# Altium schematic sheet Control.SchDoc: Control Module
size A3; SheetNumber: 2; SheetTotal: 7
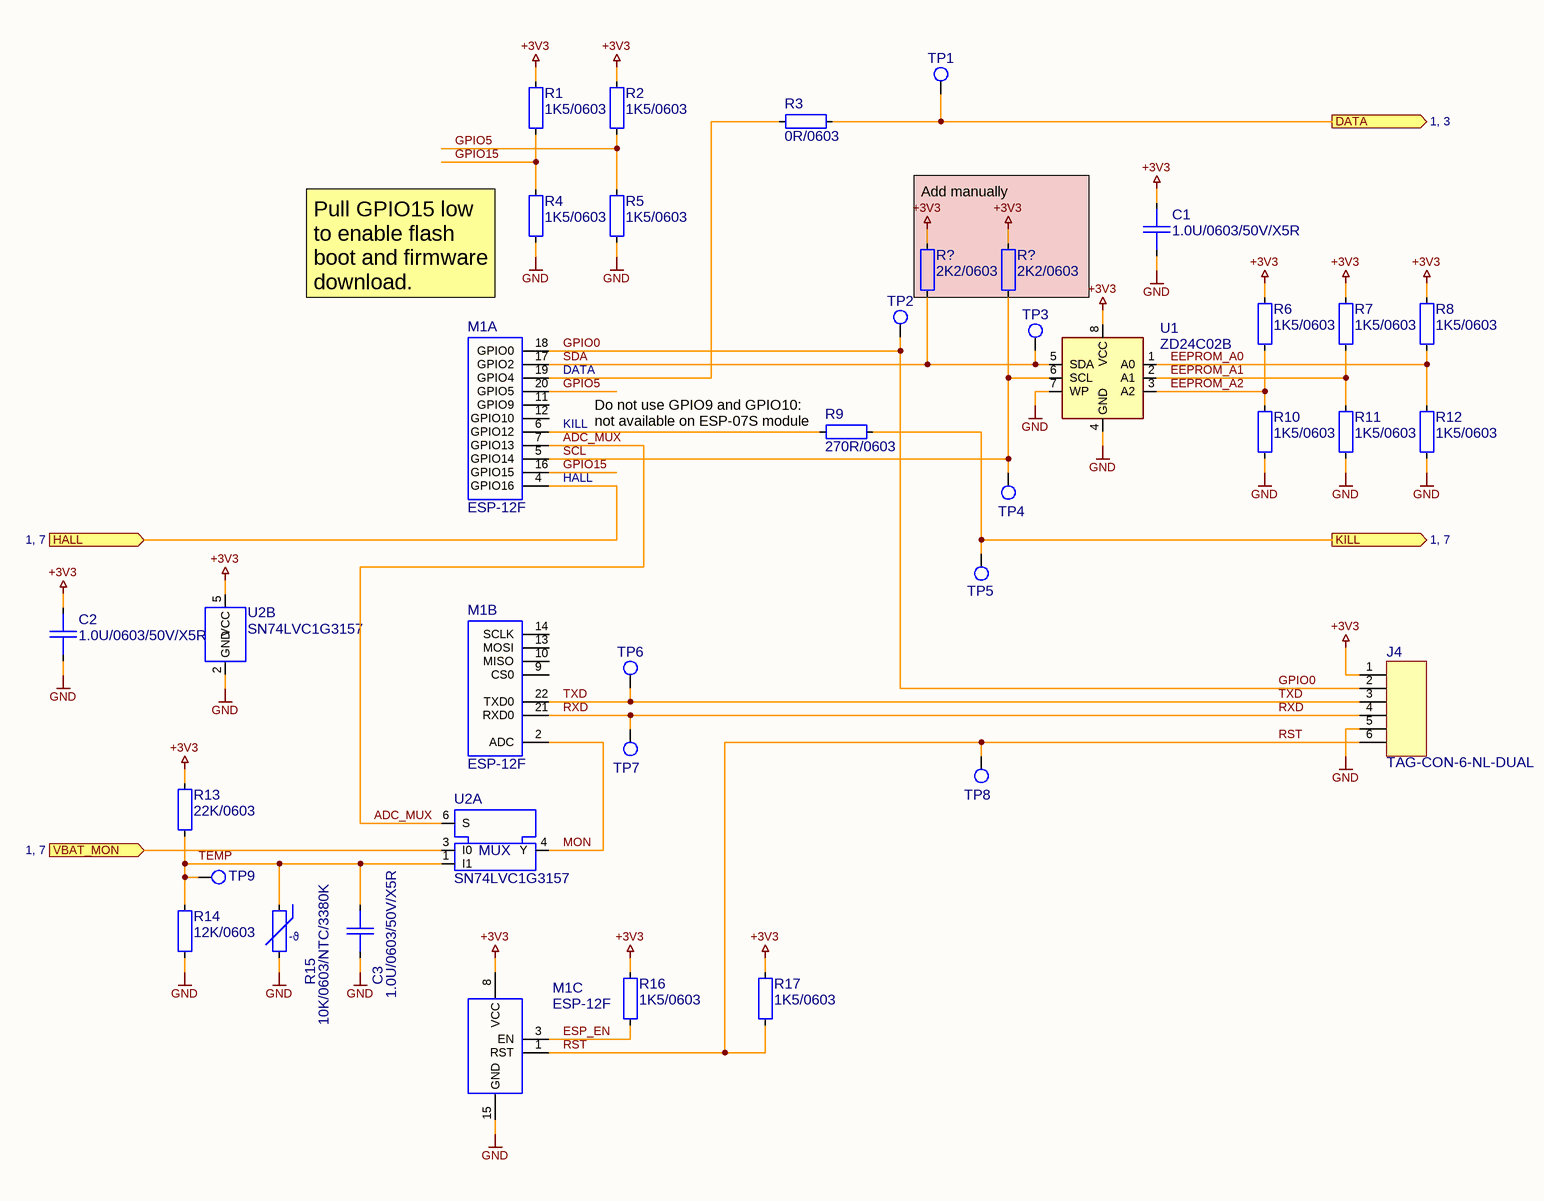
[diagram p0: Control.SchDoc]

## Parts
(Parts that share a designator on the sheet are numbered #1, #2 ... from top to bottom, then left to right.)
C1  1.0U/0603/50V/X5R  [CAP0603_X7R]
C2  1.0U/0603/50V/X5R  [CAP0603_X7R]
C3  1.0U/0603/50V/X5R  [CAP0603_X7R]
J4  TAG-CON-6-NL-DUAL  [TC2030-NL-2]
M1  ESP-12F  [ESP-12F]  (parts A,B,C of 3)
R1  1K5/0603  [R0603-0.40-WW]
R2  1K5/0603  [R0603-0.40-WW]
R3  0R/0603  [R0603-0.40-WW]
R4  1K5/0603  [R0603-0.40-WW]
R5  1K5/0603  [R0603-0.40-WW]
R6  1K5/0603  [R0603-0.40-WW]
R7  1K5/0603  [R0603-0.40-WW]
R8  1K5/0603  [R0603-0.40-WW]
R9  270R/0603  [R0603-0.40-WW]
R10  1K5/0603  [R0603-0.40-WW]
R11  1K5/0603  [R0603-0.40-WW]
R12  1K5/0603  [R0603-0.40-WW]
R13  22K/0603  [R0603-0.40-WW]
R14  12K/0603  [R0603-0.40-WW]
R15  10K/0603/NTC/3380K  [R0603-0.40-WW]
R16  1K5/0603  [R0603-0.40-WW]
R17  1K5/0603  [R0603-0.40-WW]
R?#1  2K2/0603  [R0603-0.40-WW]
R?#2  2K2/0603  [R0603-0.40-WW]
TP1  TP_THD_1.5/0.8  [TP_THD_1.5/0.8]  (value not drawn)  (no BOM)
TP2  TP_THD_1.5/0.8  [TP_THD_1.5/0.8]  (value not drawn)  (no BOM)
TP3  TP_THD_1.5/0.8  [TP_THD_1.5/0.8]  (value not drawn)  (no BOM)
TP4  TP_THD_1.5/0.8  [TP_THD_1.5/0.8]  (value not drawn)  (no BOM)
TP5  TP_THD_1.5/0.8  [TP_THD_1.5/0.8]  (value not drawn)  (no BOM)
TP6  TP_THD_1.5/0.8  [TP_THD_1.5/0.8]  (value not drawn)  (no BOM)
TP7  TP_THD_1.5/0.8  [TP_THD_1.5/0.8]  (value not drawn)  (no BOM)
TP8  TP_THD_1.5/0.8  [TP_THD_1.5/0.8]  (value not drawn)  (no BOM)
TP9  TP_THD_1.5/0.8  [TP_THD_1.5/0.8]  (value not drawn)  (no BOM)
U1  ZD24C02B  [SOP127P600X155-8-SW]
U2  SN74LVC1G3157  [SOT65P210X95-6-SE]  (parts A,B of 2)

## Ports
DATA (out, see 1, 3), HALL (in, see 1, 7), KILL (out, see 1, 7), VBAT_MON (in, see 1, 7)

## Nets
+3V3: C1.1 C2.1 J4.1 M1.8(VCC) R1.1 R2.1 R6.1 R7.1 R8.1 R13.1 R16.1 R17.1 R?#1.1 R?#2.1 U1.8(VCC) U2.5(VCC)
GND: C1.2 C2.2 C3.2 J4.5 M1.15(GND) R4.2 R5.2 R10.2 R11.2 R12.2 R14.2 R15.2 U1.4(GND) U1.7(WP) U2.2(GND)
ADC_MUX: M1.7(GPIO13) U2.6(S)
DATA: R3.2 TP1.1 ; port DATA
EEPROM_A0: R8.2 R12.1 U1.1(A0)
EEPROM_A1: R7.2 R11.1 U1.2(A1)
EEPROM_A2: R6.2 R10.1 U1.3(A2)
ESP_EN: M1.3(EN) R16.2
GPIO0: J4.2 M1.18(GPIO0) TP2.1
GPIO5: M1.20(GPIO5) R2.2 R5.1
GPIO15: M1.16(GPIO15) R1.2 R4.1
HALL: M1.4(GPIO16) ; port HALL
KILL: R9.2 TP5.1 ; port KILL
MON: M1.2(ADC) U2.4(Y)
RST: J4.6 M1.1(RST) R17.2 TP8.1
RXD: J4.4 M1.21(RXD0) TP7.1
SCL: M1.5(GPIO14) R?#2.2 TP4.1 U1.6(SCL)
SDA: M1.17(GPIO2) R?#1.2 TP3.1 U1.5(SDA)
TEMP: C3.1 R13.2 R14.1 R15.1 TP9.1 U2.1(I1)
TXD: J4.3 M1.22(TXD0) TP6.1
VBAT_MON: U2.3(I0) ; port VBAT_MON
NetM1_6: M1.6(GPIO12) R9.1
NetM1_19: M1.19(GPIO4) R3.1

Not connected (* = marked no-connect by the designer): M1 9(CS0) 10(MISO) 11(GPIO9) 12(GPIO10) 13(MOSI) 14(SCLK)

## Notes on the sheet
- Pull GPIO15 low to enable flash boot and firmware download.
- (near R?#1) Add manually
- (near M1) DATA
- (near M1) KILL
- (near M1) HALL
- (near R9) Do not use GPIO9 and GPIO10:
  not available on ESP-07S module
- Date:
- Size:
- A3
- Schema:
- Layout:
- (in symbol 10K/0603/NTC/3380K) -ϑ
- (in symbol SN74LVC1G3157, part A) MUX

## Library data of the parts
C1-C3 = 1.0U/0603/50V/X5R: CAP SM 0603 1.0uF 50V X5R; Manufacturer: GENERIC; Manufacturer 1: Samsung Electro-Mechanics; Manufacturer Part Number 1: CL10A105KB8NNNC; Absolute Value: 1E-6; Eurocircuits GPN: GPC0603105-X5R; Part Number: 1.0U/0603/50V/X5R; Package: 0603; Value: 1.0uF; Manufacturer Part Number 3: CL10A105KB8NNNC; Supplier 3: LCSC; Supplier Part Number 3: C15849; JLC Type: Basic; HelpURL: https://mm.digikey.com/Volume0/opasdata/d220001/medias/docus/658/CL10A105KB8NNNC_Spec.pdf; Supplier 1: Digi-Key; Supplier Part Number 1: 1276-1860-1-ND
J4 = TAG-CON-6-NL-DUAL: Tag-Connect 2030-NL, 6 pins, no legs, two-sided; Part Number: TAG-CON-6-NL-DUAL; Manufacturer: TAG-CONNECT; HelpURL: https://www.tag-connect.com/wp-content/uploads/bsk-pdf-manager/2022/06/TC2030-MCP-NL.pdf
M1 = ESP-12F: ESP8266 based Module with 4MByte Storage; Manufacturer: AI-Thinker; Part Number: ESP-12F; Package: Board; Manufacturer 3: Ai-Thinker; Manufacturer Part Number 3: ESP-12F(ESP8266MOD); Supplier 3: LCSC; Supplier Part Number 3: C82891; JLC Type: Extended
R1 R2 R4-R8 R10-R12 R16 R17 = 1K5/0603: RES SM 0603 1K5; Manufacturer: GENERIC; Manufacturer 1: YAGEO; Manufacturer Part Number 1: RC0603FR-131K5L; Absolute Value: 1500; Part Number: 1K5/0603; Package: 0603; Value: 1K5; HelpURL: https://www.yageo.com/upload/media/product/app/datasheet/rchip/pyu-rc_group_51_rohs_l.pdf; Supplier 1: Digi-Key; Supplier Part Number 1: 13-RC0603FR-131K5LCT-ND; Manufacturer 2: YAGEO; Manufacturer Part Number 2: RC0603FR-101K5L; Supplier 2: Digi-Key; Supplier Part Number 2: 13-RC0603FR-101K5LCT-ND; Manufacturer 3: UNI-ROYAL(Uniroyal Elec); Manufacturer Part Number 3: 0603WAF1501T5E; Supplier 3: LCSC; Supplier Part Number 3: C22843; JLC Type: Basic
R3 = 0R/0603: RES SM 0603 0R; Manufacturer: GENERIC; Manufacturer 1: YAGEO; Manufacturer Part Number 1: RC0603FR-070RL; Absolute Value: 0; Eurocircuits GPN: GPR06030R; Part Number: 0R/0603; Package: 0603; Value: 0R; HelpURL: https://www.yageo.com/upload/media/product/app/datasheet/rchip/pyu-rc_group_51_rohs_l.pdf; Supplier 1: Digi-Key; Supplier Part Number 1: 311-0.0HRCT-ND; Manufacturer 2: YAGEO; Manufacturer Part Number 2: RC0603FR-130RL; Supplier 2: Digi-Key; Supplier Part Number 2: 13-RC0603FR-130RLCT-ND; Manufacturer 3: UNI-ROYAL(Uniroyal Elec); Manufacturer Part Number 3: 0603WAF0000T5E; Supplier 3: LCSC; Supplier Part Number 3: C21189; JLC Type: Basic
R9 = 270R/0603: RES SM 0603 270R; Manufacturer: GENERIC; Manufacturer 1: YAGEO; Manufacturer Part Number 1: RC0603FR-13270RL; Absolute Value: 270; Eurocircuits GPN: GPR0603270R; Part Number: 270R/0603; Package: 0603; Value: 270R; HelpURL: https://www.yageo.com/upload/media/product/productsearch/datasheet/rchip/PYu-RC_Group_51_RoHS_L_12.pdf; Supplier 1: Digi-Key; Supplier Part Number 1: 13-RC0603FR-13270RLCT-ND; Manufacturer 2: YAGEO; Manufacturer Part Number 2: RC0603FR-10270RL; Supplier 2: Digi-Key; Supplier Part Number 2: 13-RC0603FR-10270RLCT-ND; Manufacturer 3: UNI-ROYAL(Uniroyal Elec); Manufacturer Part Number 3: 0603WAF2700T5E; Supplier 3: LCSC; Supplier Part Number 3: C22966; JLC Type: Basic
R13 = 22K/0603: RES SM 0603 22K; Manufacturer: GENERIC; Manufacturer 1: YAGEO; Manufacturer Part Number 1: RC0603FR-1322KL; Absolute Value: 22000; Eurocircuits GPN: GPR060322K; Part Number: 22K/0603; Package: 0603; Value: 22K; HelpURL: https://www.yageo.com/upload/media/product/app/datasheet/rchip/pyu-rc_group_51_rohs_l.pdf; Supplier 1: Digi-Key; Supplier Part Number 1: 13-RC0603FR-1322KLCT-ND; Manufacturer 2: YAGEO; Manufacturer Part Number 2: RC0603FR-1022KL; Supplier 2: Digi-Key; Supplier Part Number 2: 13-RC0603FR-1022KLCT-ND; Manufacturer 3: UNI-ROYAL(Uniroyal Elec); Manufacturer Part Number 3: 0603WAF2202T5E; Supplier 3: LCSC; Supplier Part Number 3: C31850; JLC Type: Basic
R14 = 12K/0603: RES SM 0603 12K; Manufacturer: GENERIC; Manufacturer 1: YAGEO; Manufacturer Part Number 1: RC0603FR-1312KL; Absolute Value: 12000; Eurocircuits GPN: GPR060312K; Part Number: 12K/0603; Package: 0603; Value: 12K; HelpURL: https://www.yageo.com/upload/media/product/app/datasheet/rchip/pyu-rc_group_51_rohs_l.pdf; Supplier 1: Digi-Key; Supplier Part Number 1: 13-RC0603FR-1312KLCT-ND; Manufacturer 2: YAGEO; Manufacturer Part Number 2: RC0603FR-1012KL; Supplier 2: Digi-Key; Supplier Part Number 2: 13-RC0603FR-1012KLCT-ND
R15 = 10K/0603/NTC/3380K: RES NTC SM 0603 10K; Manufacturer: GENERIC; Manufacturer 1: Murata; Manufacturer Part Number 1: NCU18XH103E60RB; Absolute Value: 10000; Part Number: 10K/0603/NTC/3380K; Package: 603; Value: 10K; HelpURL: https://www.murata.com/en-us/api/pdfdownloadapi?cate=luNTCforTempeSenso&partno=NCU18XH103E60RB; Supplier 1: Digi-Key; Supplier Part Number 1: 490-18164-1-ND; Manufacturer 3: Sunlord; Manufacturer Part Number 3: SDNT1608X103F3380FTF; Supplier 3: LCSC; Supplier Part Number 3: C316397; JLC Type: Extended
R?#1 R?#2 = 2K2/0603: RES SM 0603 2K2; Manufacturer: GENERIC; Manufacturer 1: YAGEO; Manufacturer Part Number 1: RC0603FR-132K2L; Absolute Value: 2200; Eurocircuits GPN: GPR06032K2; Part Number: 2K2/0603; Package: 0603; Value: 2K2; HelpURL: https://www.yageo.com/upload/media/product/app/datasheet/rchip/pyu-rc_group_51_rohs_l.pdf; Supplier 1: Digi-Key; Supplier Part Number 1: 13-RC0603FR-132K2LCT-ND; Manufacturer 2: YAGEO; Manufacturer Part Number 2: RC0603FR-102K2L; Supplier 2: Digi-Key; Supplier Part Number 2: 13-RC0603FR-102K2LCT-ND; Manufacturer 3: YAGEO; Manufacturer Part Number 3: RC0603JR-072K2L; Supplier 3: LCSC; Supplier Part Number 3: C113303
TP1-TP9 = TP_THD_1.5/0.8: THT Test Point 1.5/0.8mm; Manufacturer: NONE; Part Number: TP_THD_1.5/0.8
U1 = ZD24C02B: I2C-Compatible (2-wire) Serial EEPROM 2K bits; Manufacturer: Zetta; Part Number: ZD24C02B; Package: SOIC-8; HelpURL: https://datasheet.lcsc.com/lcsc/2402020955_Zetta-ZD24C02B-SSGMB_C5374786.pdf; Manufacturer 3: Zetta; Manufacturer Part Number 3: ZD24C02B-SSGMB; Supplier 3: LCSC; Supplier Part Number 3: C5374786; JLC Type: Extended
U2 = SN74LVC1G3157: Single-Pole-Double-Throw Analog Switch; Manufacturer: TI; Part Number: SN74LVC1G3157; Package: SOT-363-6; Manufacturer 3: Texas Instruments; Manufacturer Part Number 3: SN74LVC1G3157DCKR; Supplier 3: LCSC; Supplier Part Number 3: C38663